# Altium project LM399_V2.PrjPcb
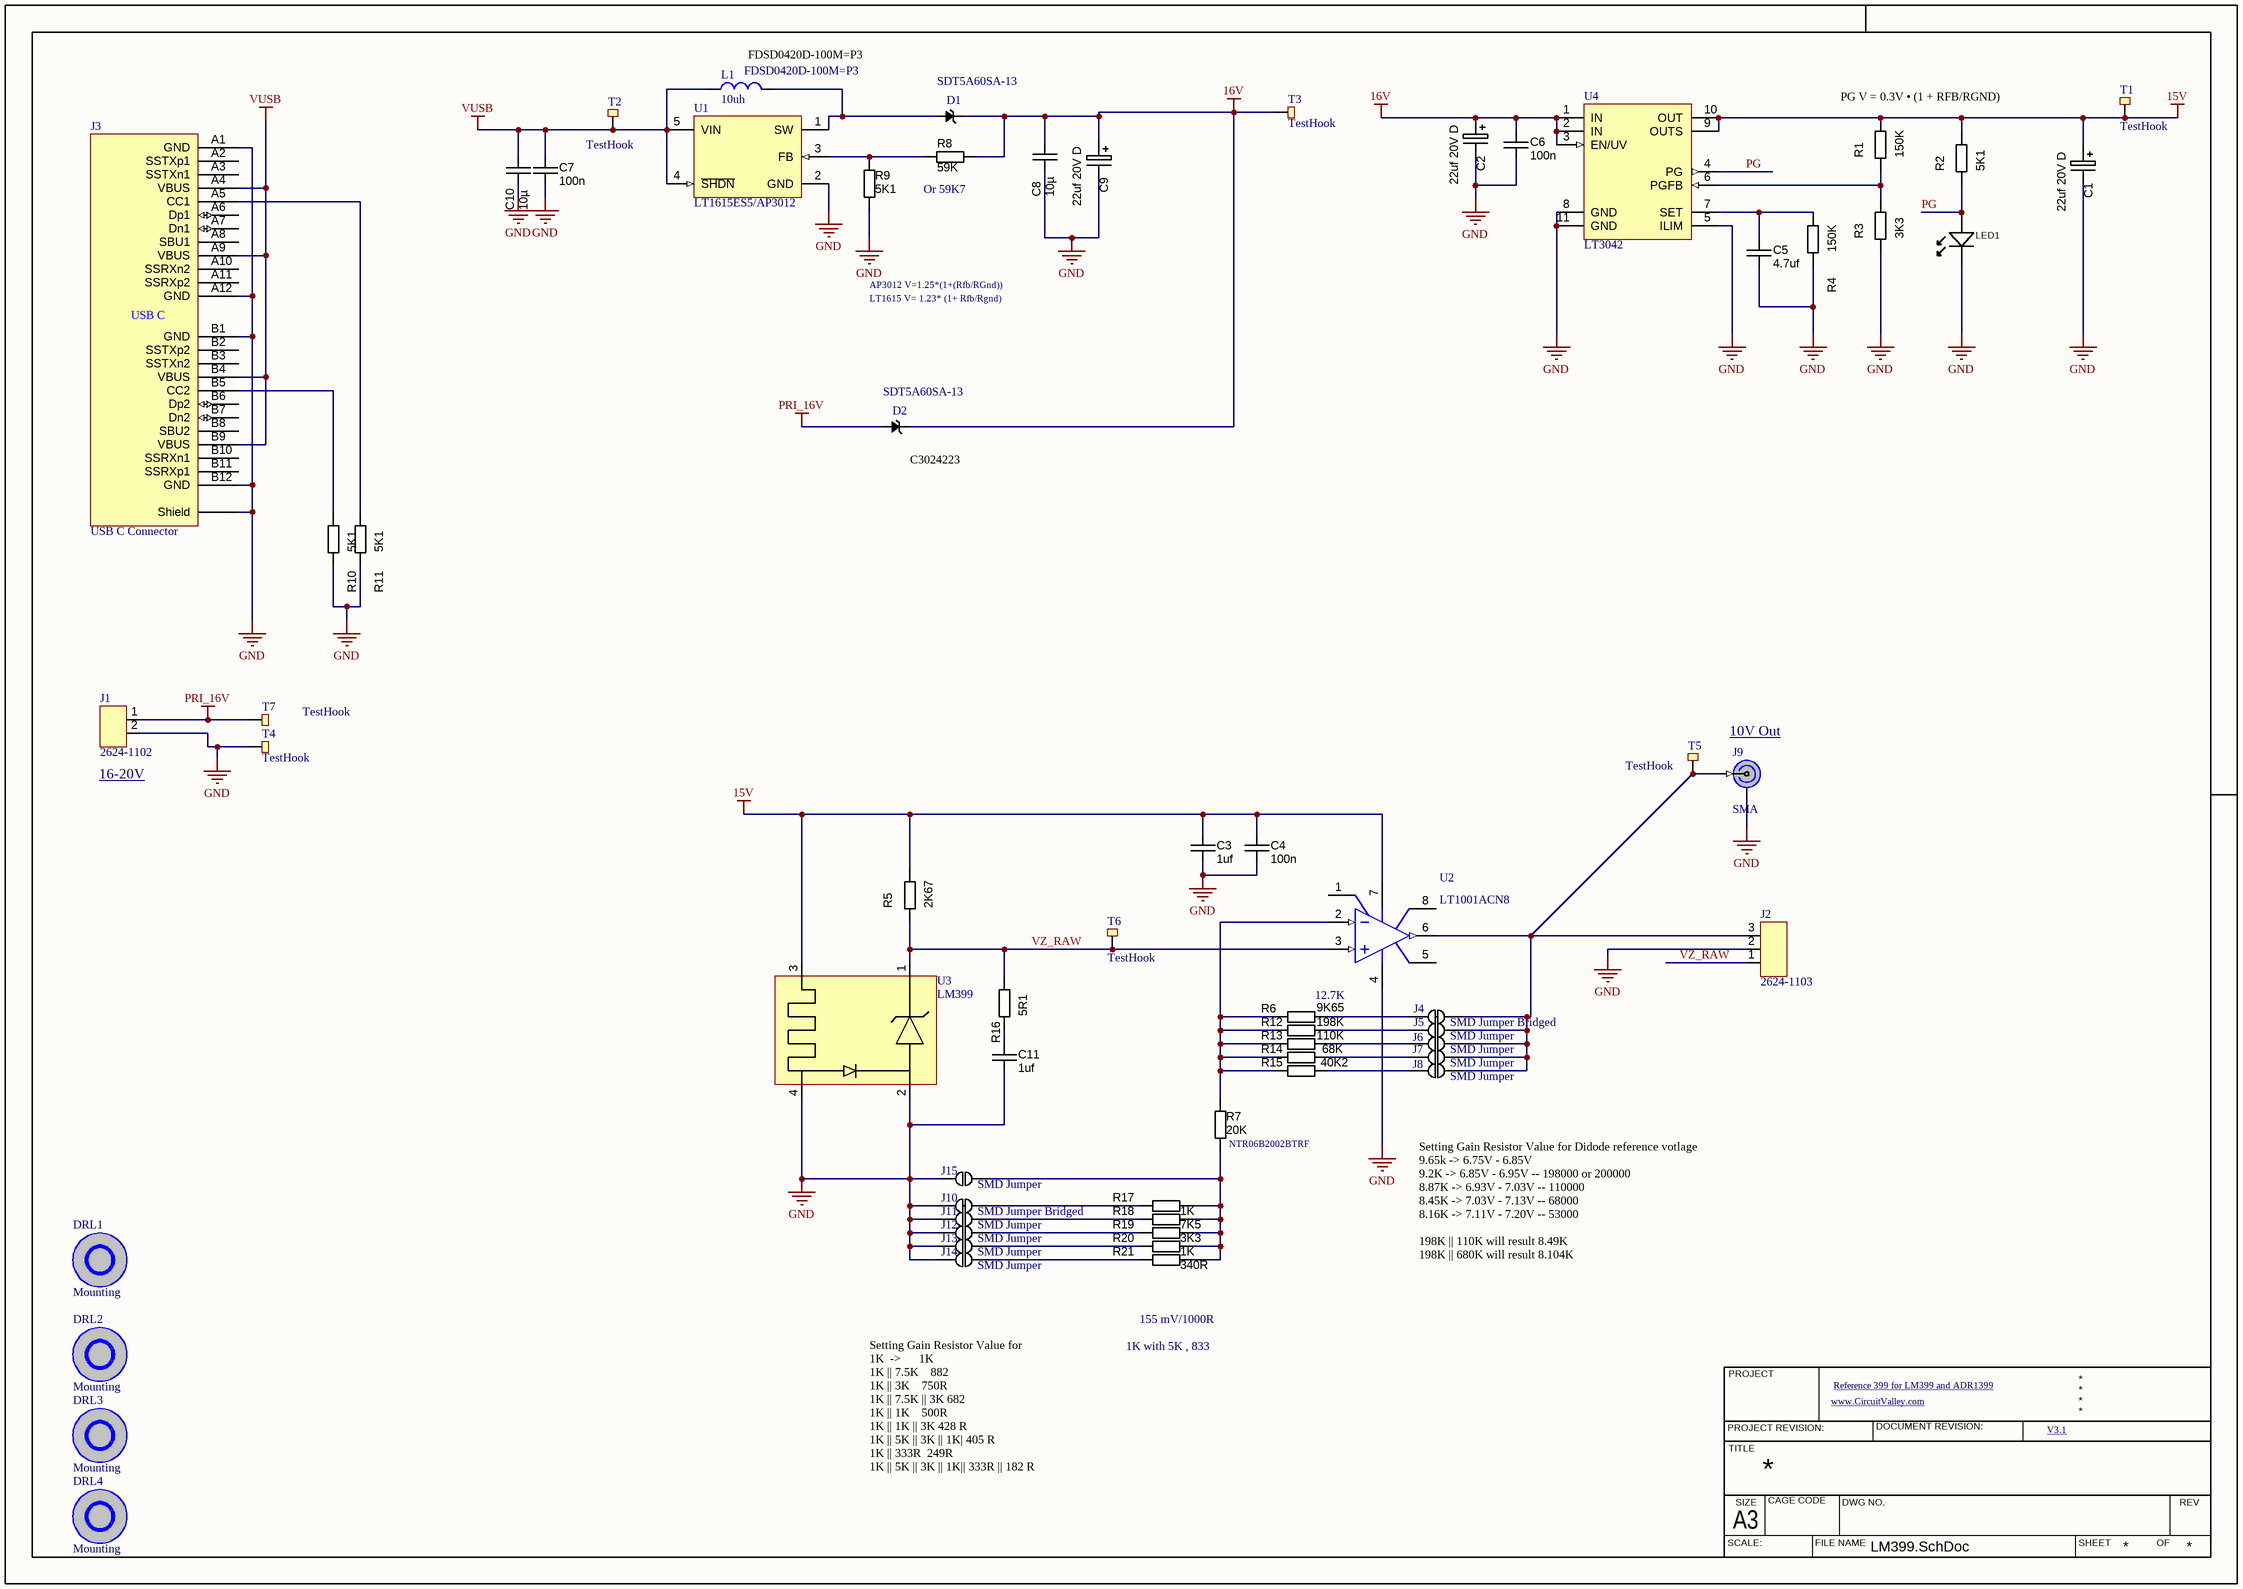
[diagram p0: LM399.SchDoc]
1 sheet, 66 parts. Net scope: global (net labels, ports and power ports of the same name join across sheets).
Board files: LM399.PcbDoc, Frontbezel.PcbDoc, BackBezel.PcbDoc

## Sheet LM399.SchDoc
size 420 x 297 mm

### Parts
C1  value 22uf 20V D  [CAPMP7343X310N]  (hidden comment: 47uf 20V D)
C2  value 22uf 20V D  [CAPMP7343X310N]  (hidden comment: 47uf 20V D)
C3  value 1uf  [CAPC1608N]  (hidden comment: approved sub OK)
C4  value 100n  [CAPC1608N]  (hidden comment: approved sub OK)
C5  value 4.7uf  [CAPC1608N]  (hidden comment: approved sub OK)
C6  value 100n  [CAPC1608N]  (hidden comment: approved sub OK)
C7  value 100n  [CAPC1608N]  (hidden comment: approved sub OK)
C8  10µ  [CAPC3225N]
C9  value 22uf 20V D  [CAPMP7343X310N]  (hidden comment: 47uf 20V D)
C10  10µ  [CAPC3225N]
C11  value 1uf  [CAPC1608N]  (hidden comment: approved sub OK)
D1  SDT5A60SA-13  [DO-214AC]
D2  SDT5A60SA-13  [DO-214AC]
DRL1  Mounting  [NO_COPPER_NOMASK_2m75_6m2]
DRL2  Mounting  [NO_COPPER_NOMASK_2m75_6m2]
DRL3  Mounting  [NO_COPPER_NOMASK_2m75_6m2]
DRL4  Mounting  [NO_COPPER_NOMASK_2m75_6m2]
J1  2624-1102  [2624-1102]
J2  2624-1103  [2624-1103]
J3  USB C Connector  [UT11113-11602-7H]
J4  SMD Jumper Bridged  [SMD_Jumper_bridge]  (net tie, no BOM)
J5  SMD Jumper  [SMD_Jumper]  (net tie, no BOM)
J6  SMD Jumper  [SMD_Jumper]  (net tie, no BOM)
J7  SMD Jumper  [SMD_Jumper]  (net tie, no BOM)
J8  SMD Jumper  [SMD_Jumper]  (net tie, no BOM)
J9  SMA  [SMA_Connector]
J10  SMD Jumper Bridged  [SMD_Jumper_bridge]  (net tie, no BOM)
J11  SMD Jumper  [SMD_Jumper]  (net tie, no BOM)
J12  SMD Jumper  [SMD_Jumper]  (net tie, no BOM)
J13  SMD Jumper  [SMD_Jumper]  (net tie, no BOM)
J14  SMD Jumper  [SMD_Jumper]  (net tie, no BOM)
J15  SMD Jumper  [SMD_Jumper]  (net tie, no BOM)
L1  10uh  value FDSD0420D-100M=P3  [FDSD0420-H-2R2M]
LED1  (no value)  [LED-0805-K]
R1  value 150K  [RESC1608N]  (hidden comment: RES_NL_0603)
R2  value 5K1  [RESC1608N]  (hidden comment: RES_NL_0603)
R3  value 3K3  [RESC1608N]  (hidden comment: RES_NL_0603)
R4  value 150K  [RESC1608N]  (hidden comment: RES_NL_0603)
R5  value 2K67  [RESC1608N]  (hidden comment: RES_NL_0603)
R6  value 9K65  [RESC1608N]  (hidden comment: RES_NL_0603)
R7  value 20K  [RESC1608N]  (hidden comment: RES_NL_0603)
R8  value 59K  [RESC1608N]  (hidden comment: RES_NL_0603)
R9  value 5K1  [RESC1608N]  (hidden comment: RES_NL_0603)
R10  value 5K1  [RESC1608N]  (hidden comment: RES_NL_0603)
R11  value 5K1  [RESC1608N]  (hidden comment: RES_NL_0603)
R12  value 198K  [RESC1608N]  (hidden comment: RES_NL_0603)
R13  value 110K  [RESC1608N]  (hidden comment: RES_NL_0603)
R14  value 68K  [RESC1608N]  (hidden comment: RES_NL_0603)
R15  value 40K2  [RESC1608N]  (hidden comment: RES_NL_0603)
R16  value 5R1  [RESC1608N]  (hidden comment: RES_NL_0603)
R17  value 1K  [RESC1608N]  (hidden comment: RES_NL_0603)
R18  value 7K5  [RESC1608N]  (hidden comment: RES_NL_0603)
R19  value 3K3  [RESC1608N]  (hidden comment: RES_NL_0603)
R20  value 1K  [RESC1608N]  (hidden comment: RES_NL_0603)
R21  value 340R  [RESC1608N]  (hidden comment: RES_NL_0603)
T1  TestHook  [Test_PAD_0851-0-15-20-82-14-11-0]
T2  TestHook  [Test_PAD_0851-0-15-20-82-14-11-0]
T3  TestHook  [Test_PAD_0851-0-15-20-82-14-11-0]
T4  TestHook  [Test_PAD_0851-0-15-20-82-14-11-0]
T5  TestHook  [Test_PAD_0851-0-15-20-82-14-11-0]
T6  TestHook  [Test_PAD_0851-0-15-20-82-14-11-0]
T7  TestHook  [Test_PAD_0851-0-15-20-82-14-11-0]
U1  LT1615ES5/AP3012  [SOT23-5]
U2  LT1001ACN8  [N8]
U3  LM399  [TO-46]
U4  LT3042  [MSOP10]

### Nets
15V: C1.1 C3.1 C4.1 R1.1 R2.1 R5.1 T1.1(TP) U2.7(V+) U3.3(H1) U4.9(OUTS) U4.10(OUT)
16V: C2.1 C6.1 C8.1 C9.1 D1.2 D2.2 R8.2 T3.1(TP) U4.1(IN) U4.2(IN) U4.3(EN/UV)
GND: C1.2 C2.2 C3.2 C4.2 C5.2 C6.2 C7.2 C8.2 C9.2 C10.2 C11.2 J1.2(PW) J2.2 J3.0(Shield) J3.A1(GND) J3.A12(GND) J3.B1(GND) J3.B12(GND) J9.2 J10.2 J11.2 J12.2 J13.2 J14.2 J15.2 LED1.K R3.2 R4.2 R9.1 R10.2 R11.2 T4.1(TP) U1.2(GND) U2.4(V-) U3.2(D2) U3.4(H2) U4.5(ILIM) U4.8(GND) U4.11(GND)
PRI_16V: D2.1 J1.1(PW) T7.1(TP)
VUSB: C7.1 C10.1 J3.A4(VBUS) J3.A9(VBUS) J3.B4(VBUS) J3.B9(VBUS) L1.1 T2.1(TP) U1.4(~{SHDN}) U1.5(VIN)
PG: LED1.A R2.2 U4.4(PG)
VZ_RAW: J2.1 R5.2 R16.1 T6.1(TP) U2.3(IN+) U3.1(D1)
NetC5_1: C5.1 R4.1 U4.7(SET)
NetC11_1: C11.1 R16.2
NetD1_1: D1.1 L1.2 U1.1(SW)
NetJ2_3: J2.3 J4.1 J5.1 J6.1 J7.1 J8.1 J9.1 T5.1(TP) U2.6(OUT)
NetJ3_A5: J3.A5(CC1) R11.1
NetJ3_B5: J3.B5(CC2) R10.1
NetJ4_2: J4.2 R6.2
NetJ5_2: J5.2 R12.2
NetJ6_2: J6.2 R13.2
NetJ7_2: J7.2 R14.2
NetJ8_2: J8.2 R15.2
NetJ10_1: J10.1 R17.2
NetJ11_1: J11.1 R18.2
NetJ12_1: J12.1 R19.2
NetJ13_1: J13.1 R20.2
NetJ14_1: J14.1 R21.2
NetJ15_1: J15.1 R7.2 R17.1 R18.1 R19.1 R20.1 R21.1
NetR1_2: R1.2 R3.1 U4.6(PGFB)
NetR6_1: R6.1 R7.1 R12.1 R13.1 R14.1 R15.1 U2.2(IN-)
NetR8_1: R8.1 R9.2 U1.3(FB)

Not connected (* = marked no-connect by the designer): J3 A2(SSTXp1) A3(SSTXn1) A6(Dp1) A7(Dn1) A8(SBU1) A10(SSRXn2) A11(SSRXp2) B2(SSTXp2) B3(SSTXn2) B6(Dp2) B7(Dn2) B8(SBU2) B10(SSRXn1) B11(SSRXp1); U2 1(VOSTRIM) 5(NC) 8(VOSTRIM)

### Notes on the sheet
- (near L1) FDSD0420D-100M=P3
- PG V = 0.3V • (1 + RFB/RGND)
- (near R8) Or 59K7
- AP3012 V=1.25*(1+(Rfb/RGnd))
- LT1615 V= 1.23* (1+ Rfb/Rgnd)
- (near D2) C3024223
- (near J1) 16-20V
- 10V Out
- (near R6) 12.7K
- (near R7) NTR06B2002BTRF
- Setting Gain Resistor Value for Didode reference votlage
  9.65k -> 6.75V - 6.85V
  9.2K -> 6.85V - 6.95V -- 198000 or 200000
  8.87K -> 6.93V - 7.03V -- 110000
  8.45K -> 7.03V - 7.13V -- 68000
  8.16K -> 7.11V - 7.20V -- 53000
  198K || 110K will result 8.49K
  198K || 680K will result 8.104K
- 155 mV/1000R
- 1K with 5K , 833
- www.CircuitValley.com
- Reference 399 for LM399 and ADR1399
- Setting Gain Resistor Value for
  1K  ->      1K
  1K || 7.5K    882
  1K || 3K    750R
  1K || 7.5K || 3K 682
  1K || 1K    500R
  1K || 1K || 3K 428 R
  1K || 5K || 3K || 1K| 405 R
  1K || 333R  249R
  1K || 5K || 3K || 1K|| 333R || 182 R
- V3.1
- PROJECT
- PROJECT REVISION:
- TITLE
- DOCUMENT REVISION:
- SCALE:
- A3
- SIZE
- CAGE CODE
- FILE NAME
- DWG NO.
- SHEET
- OF
- REV
- (in symbol USB_C) USB C

### Library data of the parts
C1 C2 C9 = CAPT_330u_2917_6V3: Capacitor SMD Tant 330uF 20% 6V3 2917; Manufacturer Part Number: T520D337M006ATE015; Part: TCJY226M025R0070; Ratings: 6.3V; Material: Solid Tantalum; ESR (Equivalent Series Resistance): 15 mOhm; Package / Case: 2917 (7343 Metric); Tolerance: ±20%; Operating Temperature: -55°C ~ 125°C; Size / Dimension: 0.287" L x 0.169" W (7.30mm x 4.30mm); Height - Seated (Max): 0.122" (3.10mm); Manufacturer Size Code: D; Supplier 1: Digi-Key; Supplier Part Number 1: 399-4052-1-ND; ComponentLink1URL: http://www.kemet.com/datasheets&T520D337M006ATE015; ComponentLink1Description: T520D Datasheet
C3-C7 C11 = CAPC_1n_0603_100V: Capacitor SMD Cer 1nF 10% 100V X7R 0603; Manufacturer 1: Murata Electronics North America; Manufacturer Part Number 1: GCM188R72A102KA37D; Ratings: 100V; X7R; Material: ceramic; Package / Case: 0603 (1608 metric); Tolerance: ±10%; Supplier 1: Digi-Key; Supplier Part Number 1: 490-4780-1-ND; Operating Temperature: -55°C ~ 125°C; Size / Dimension: 0.063" L x 0.031" W (1.60mm x 0.80mm); Thickness (Max): 0.035" (0.90mm); ComponentLink1URL: http://search.murata.co.jp/Ceramy/image/img/PDF/ENG/GCM188R72A102KA37.pdf; ComponentLink1Description: http://search.murata.co.jp/Ceramy/image/img/PDF/ENG/GCM188R72A102KA37.pdf
C8 C10 = CAPC_10u_1210_50V: Capacitor SMD Cer 10uF 20% 16V X5R 1210; Manufacturer 1: Taiyo Yuden; Manufacturer Part Number 1: UMK325BJ106MM-T; Ratings: 50V; X5R; Material: ceramic; Package / Case: 1210 (3225 Metric); Tolerance: ±20%; Size / Dimension: 0.126" L x 0.098" W (3.20mm x 2.50mm); Supplier 1: Digi-Key; Supplier Part Number 1: 587-2225-1-ND; Value: 10µ
D1 D2 = Schottky_diode
DRL1-DRL4 = Mountinghole: Mounting Hole
J3 = USB_C
J4 J10 = SMD_Jumper_Bridged: SMD Jumper
J5-J8 J11-J15 = SMD_Jumper
J9 = SMA Connector
L1 = inductor_smd
LED1 = LED_SMD_Green_0805: LED, 0805 SMD, Green; Manufacturer 1: Ligitek; Manufacturer Part Number 1: LG170G-CT; Material: GaP; Ratings: 10 mcd; 573 nm; Package / Case: 0805
R1-R21 = RES_NL_0603: Resistor, SMD chip; Manufacturer 1: Royal Ohm; Ratings: 1/10 W; Tolerance: ±5%; Package / Case: 0603 (1608 metric)
U1 = AP3012: Boost Conveter
U2 = LT1001ACN8: General Purpose, High Precision Op Amp; Note: Pin 5 is NC (not internally connected) pin.; Note: 56; Published: 8-Jun-2000; LatestRevisionDate: 29-May-2009; LatestRevisionNote: Component Body Added.; DatasheetVersion: 1990; PackageVersion: N8 1002; PackageReference: N8; Publisher: Altium Limited; PackageDescription: DIP, Plastic, 8-Pin, Row Spacing 7.62 mm, Pitch 2.54 mm; ComponentLink1Description: Manufacturer Link; ComponentLink1URL: http://www.linear.com/; ComponentLink2Description: Datasheet; ComponentLink2URL: http://www.linear.com/pc/downloadDocument.do?navId=H0,C1,C1154,C1009,C1021,P1206,D1672
U4 = LT3042: Low noise Linear Regulator
U3 = LM399: Part: LM399